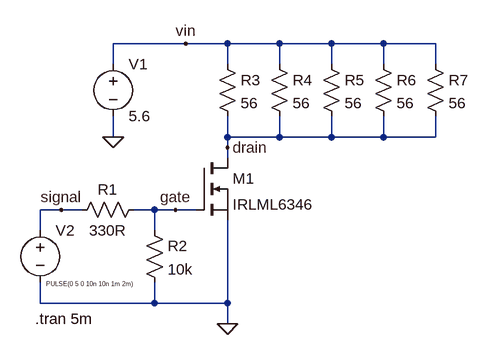
[diagram p0: schematic 10-transient_load.asc]
10-transient_load.asc, the LTspice schematic file:
Version 4
SHEET 1 880 680
WIRE 240 32 128 32
WIRE 304 32 240 32
WIRE 384 32 304 32
WIRE 464 32 384 32
WIRE 544 32 464 32
WIRE 624 32 544 32
WIRE 128 64 128 32
WIRE 304 64 304 32
WIRE 384 64 384 32
WIRE 464 64 464 32
WIRE 544 64 544 32
WIRE 624 64 624 32
WIRE 128 176 128 144
WIRE 304 176 304 144
WIRE 384 176 384 144
WIRE 384 176 304 176
WIRE 464 176 464 144
WIRE 464 176 384 176
WIRE 544 176 544 144
WIRE 544 176 464 176
WIRE 624 176 624 144
WIRE 624 176 544 176
WIRE 304 192 304 176
WIRE 304 208 304 192
WIRE 48 288 16 288
WIRE 80 288 48 288
WIRE 192 288 160 288
WIRE 224 288 192 288
WIRE 256 288 224 288
WIRE 16 320 16 288
WIRE 192 320 192 288
WIRE 16 432 16 400
WIRE 192 432 192 400
WIRE 192 432 16 432
WIRE 304 432 304 304
WIRE 304 432 192 432
WIRE 304 464 304 432
FLAG 304 464 0
FLAG 128 176 0
FLAG 48 288 signal
FLAG 224 288 gate
FLAG 304 192 drain
FLAG 240 32 vin
SYMBOL voltage 128 48 R0
WINDOW 123 0 0 Left 0
WINDOW 39 0 0 Left 0
SYMATTR InstName V1
SYMATTR Value 5.6
SYMBOL res 288 48 R0
SYMATTR InstName R3
SYMATTR Value 56
SYMATTR SpiceLine tol=5 pwr=1
SYMBOL nmos 256 208 R0
SYMATTR InstName M1
SYMATTR Value IRLML6346
SYMBOL res 176 304 R0
SYMATTR InstName R2
SYMATTR Value 10k
SYMBOL res 176 272 R90
WINDOW 0 0 56 VBottom 2
WINDOW 3 32 56 VTop 2
SYMATTR InstName R1
SYMATTR Value 330R
SYMBOL voltage 16 304 R0
WINDOW 3 9 98 Left 0
WINDOW 123 0 0 Left 0
WINDOW 39 0 0 Left 0
SYMATTR Value PULSE(0 5 0 10n 10n 1m 2m)
SYMATTR InstName V2
SYMBOL res 368 48 R0
SYMATTR InstName R4
SYMATTR Value 56
SYMATTR SpiceLine tol=5 pwr=1
SYMBOL res 448 48 R0
SYMATTR InstName R5
SYMATTR Value 56
SYMATTR SpiceLine tol=5 pwr=1
SYMBOL res 528 48 R0
SYMATTR InstName R6
SYMATTR Value 56
SYMATTR SpiceLine tol=5 pwr=1
SYMBOL res 608 48 R0
SYMATTR InstName R7
SYMATTR Value 56
SYMATTR SpiceLine tol=5 pwr=1
TEXT 8 456 Left 2 !.tran 5m

The netlist it stands for:
* 10-transient_load.asc
V1 vin 0 5.6
R3 vin drain 56 tol=5 pwr=1
M1 drain gate 0 0 IRLML6346
R2 gate 0 10k
R1 gate signal 330R
V2 signal 0 PULSE(0 5 0 10n 10n 1m 2m)
R4 vin drain 56 tol=5 pwr=1
R5 vin drain 56 tol=5 pwr=1
R6 vin drain 56 tol=5 pwr=1
R7 vin drain 56 tol=5 pwr=1
.model NMOS NMOS
.model PMOS PMOS
.lib standard.mos
.tran 5m
.backanno
.end

* Results of the author's LTspice run, read from the files saved beside the schematic
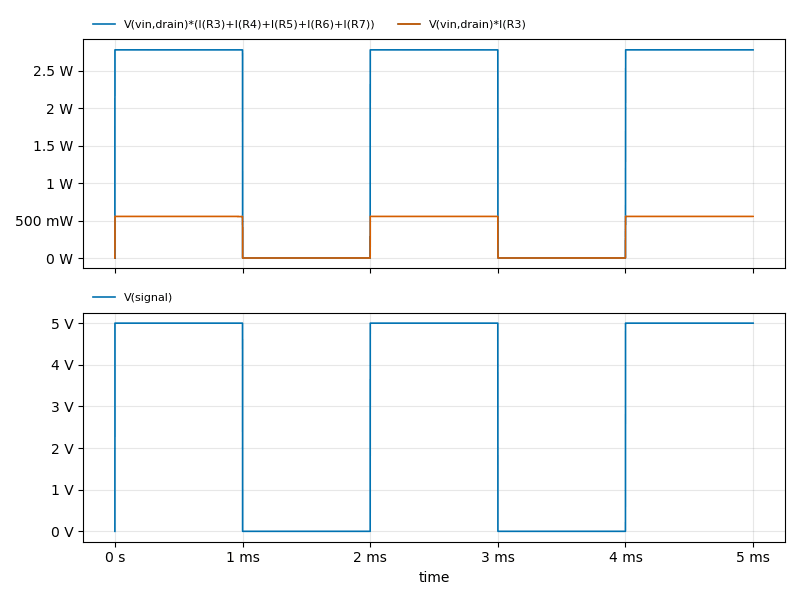
[diagram p1: Transient Analysis of 10-transient_load.asc, plotted from the saved traces]
* Transient Analysis, 1 run:
*   V(vin,drain)*(I(R3)+I(R4)+I(R5)+I(R6)+I(R7)): min 0 W, max 2.778 W, average 1.667 W, rms 2.152 W, last 2.778 W
*   V(vin,drain)*I(R3): min 0 W, max 555.7 mW, average 333.4 mW, rms 430.4 mW, last 555.6 mW
*   V(signal): min 0 V, max 5 V, average 3 V, rms 3.873 V, last 5 V